# EAGLE design AF_mshield-v12 (EAGLE 5.01)
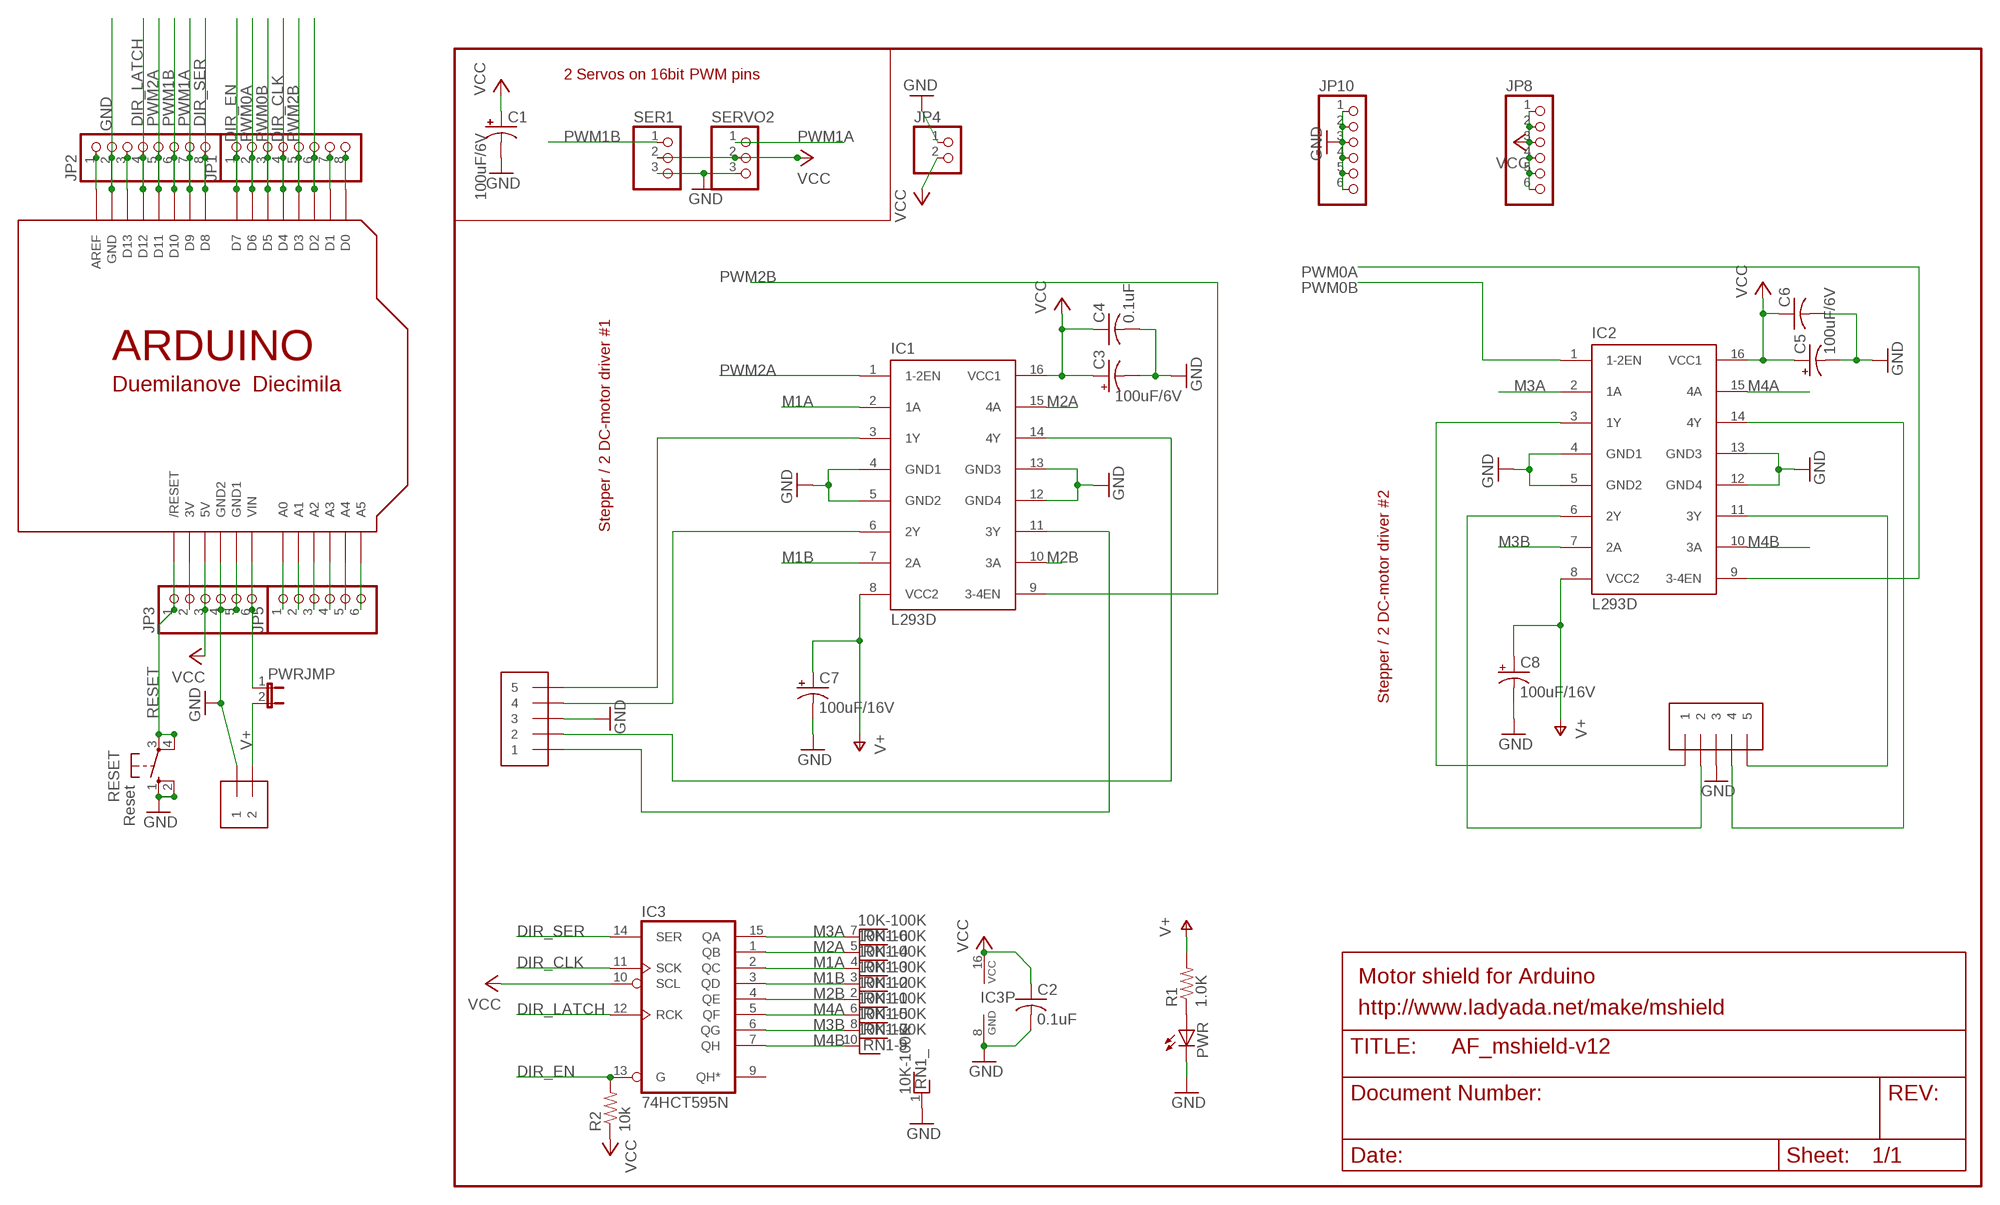
[diagram p0: schematic, sheet 1]

## Parts
C1  100uF/6V  CPOL-USE2.5-5  [E2,5-5]
C2  0.1uF  C-US025-025X050  [C025-025X050]
C3  100uF/6V  CPOL-USE2.5-5  [E2,5-5]
C4  0.1uF  C-US025-025X050  [C025-025X050]
C5  100uF/6V  CPOL-USE2.5-5  [E2,5-5]
C6  C-US025-025X050  [C025-025X050]
C7  100uF/16V  CPOL-USE2.5-6  [E2,5-6]
C8  100uF/16V  CPOL-USE2.5-6  [E2,5-6]
IC1  L293D  L293E  [DIL16]
IC2  L293D  L293E  [DIL16]
IC3  74HCT595N  [DIL16]
J1  1X5  [1X05-3.5MM]
J2  1X5  [1X05-3.5MM]
J3  1X2-3.5MM  [1X2-3.5MM]
JP1  PINHD-1X8CLEANBIG  [1X08-CLEANBIG]
JP2  PINHD-1X8CLEANBIG  [1X08-CLEANBIG]
JP3  PINHD-1X6CB  [1X06-CLEANBIG]
JP4  PINHD-1X2  [1X02]
JP5  PINHD-1X6CB  [1X06-CLEANBIG]
JP8  PINHD-1X6B  [1X06-BIG]
JP10  PINHD-1X6B  [1X06-BIG]
PWR  LED3MM  [LED3MM]
PWRJMP  JP1E  [JP1]
R1  1.0K  R-US_0207/10  [0207/10]
R2  10k  R-US_0207/10  [0207/10]
RESET  Reset  10-XX  [B3F-10XX]
RN1  10K-100K  RNX9  [RN-10]
SER1  PINHD-1X3  [1X03]
SERVO2  PINHD-1X3  [1X03]
U$1  ARDUINO-NOHOLE  [ARDUINO-NOHOLE]

## Nets
9V: JP3.6 PWRJMP.1 U$1.VIN
DIR_CLK: IC3.11(SCK) JP1.4 U$1.D4
DIR_EN: IC3.13(G) JP1.1 R2.2 U$1.D7
DIR_LATCH: IC3.12(RCK) JP2.4 U$1.D12
DIR_SER: IC3.14(SER) JP2.8 U$1.D8
GND [power]: C1.- C2.2 C3.- C4.2 C5.- C6.2 C7.- C8.- IC1.4(GND1) IC1.5(GND2) IC1.12(GND4) IC1.13(GND3) IC2.4(GND1) IC2.5(GND2) IC2.12(GND4) IC2.13(GND3) IC3.8(GND) J1.3 J2.3 J3.1 JP2.2 JP3.4 JP3.5 JP4.1 JP10.1 JP10.2 JP10.3 JP10.4 JP10.5 JP10.6 PWR.K(C) RESET.1(S) RESET.2(S1) RN1.1 SER1.3 SERVO2.3 U$1.GND U$1.GND1 U$1.GND2
M1A: IC1.2(1A) IC3.2(QC) RN1.4
M1B: IC1.7(2A) IC3.3(QD) RN1.3
M2A: IC1.15(4A) IC3.1(QB) RN1.5
M2B: IC1.10(3A) IC3.4(QE) RN1.2
M3A: IC2.2(1A) IC3.15(QA) RN1.7
M3B: IC2.7(2A) IC3.6(QG) RN1.8
M4A: IC2.15(4A) IC3.5(QF) RN1.6
M4B: IC2.10(3A) IC3.7(QH) RN1.10
N$1: IC1.3(1Y) J1.5
N$2: JP5.1 U$1.A0
N$3: JP5.2 U$1.A1
N$4: JP5.3 U$1.A2
N$5: JP5.4 U$1.A3
N$6: JP5.5 U$1.A4
N$7: IC2.3(1Y) J2.1
N$8: IC2.6(2Y) J2.2
N$9: IC2.11(3Y) J2.5
N$10: JP1.6 U$1.D2
N$11: JP1.7 U$1.D1
N$12: JP1.8 U$1.D0
N$13: JP5.6 U$1.A5
N$14: JP2.1 U$1.AREF
N$15: JP2.3 U$1.D13
N$17: JP3.2 U$1.3V
N$20: IC2.14(4Y) J2.4
N$31: IC1.6(2Y) J1.4
N$32: IC1.11(3Y) J1.1
N$33: IC1.14(4Y) J1.2
N$35: PWR.A R1.1
PWM0A: IC2.9(3-4EN) JP1.2 U$1.D6
PWM0B: IC2.1(1-2EN) JP1.3 U$1.D5
PWM1A: JP2.7 SERVO2.1 U$1.D9
PWM1B: JP2.6 SER1.1 U$1.D10
PWM2A: IC1.1(1-2EN) JP2.5 U$1.D11
PWM2B: IC1.9(3-4EN) JP1.5 U$1.D3
RESET: JP3.1 RESET.3(P) RESET.4(P1) U$1.RESET(/RESET)
V+: C7.+ C8.+ IC1.8(VCC2) IC2.8(VCC2) J3.2 PWRJMP.2 R1.2
VCC: C1.+ C2.1 C3.+ C4.1 C5.+ C6.1 IC1.16(VCC1) IC2.16(VCC1) IC3.10(SCL) IC3.16(VCC) JP3.3 JP4.2 JP8.1 JP8.2 JP8.3 JP8.4 JP8.5 JP8.6 R2.1 SER1.2 SERVO2.2 U$1.5V
Unconnected: IC3.9(QH*) RN1.9

## Notes on the sheet
- 2 Servos on 16bit PWM pins
- Stepper / 2 DC-motor driver #1
- Stepper / 2 DC-motor driver #2
- Motor shield for Arduino
- http://www.ladyada.net/make/mshield

## Library data of the parts
C1 C3 C5 C7 C8 = rcl-ez:CPOL-US: POLARIZED CAPACITOR, American symbol
C2 C4 C6 = rcl-ez:C-US: CAPACITOR, American symbol
IC1 IC2 = texas:L293E: TI DEVICE
IC3 = 74xx-eu:74*595: 8-bit SHIFT REGISTER, output latch
J1 J2 = adafruit:1X5
J3 = adafruit:1X2: 3.5mm Terminal block http://www.ladyada.net/library/pcb/eaglelibrary.html
JP1 JP2 = adafruit:PINHD-1X8: PIN HEADER
JP3 = adafruit:PINHD-1X6: PIN HEADER
JP4 = pinhead:PINHD-1X2: PIN HEADER
JP5 JP8 JP10 = carduino:PINHD-1X6: PIN HEADER
PWR = minimidi:LED: LED OSRAM: - CHIPLED LG R971, LG N971, LY N971, LG Q971, LY Q971, LO R971, LY R971 LH N974, LH R974 LS Q976, LO Q976, LY Q976 LO Q996 - Hyper CHIPLED LW Q18S LB Q993, LB Q99A, LB R99A - SideLED LS A670, LO A670, LY A670, LG A670, LP A670 LB A673, LV A673, LT A673, LW A673 LH A674 LY A675 LS A676, LA A676, LO A676, LY A676, LW A676 LS A679, LY A679, LG A679 - Hyper Micro SIDELED® LS Y876, LA Y876, LO Y876, LY Y876 LT Y87S - SmartLED LW L88C, LW L88S LB L89C, LB L89S, LG L890 LS L89K, LO L89K, LY L89K LS L896, LA L896, LO L896, LY L896 - TOPLED LS T670, LO T670, LY T670, LG T670, LP T670 LSG T670, LSP T670, LSY T670, LOP T670, LYG T670 LG T671, LOG T671, LSG T671 LB T673, LV T673, LT T673, LW T673 LH T674 LS T676, LA T676, LO T676, LY T676, LB T676, LH T676, LSB T676, LW T676 LB T67C, LV T67C, LT T67C, LS T67K, LO T67K, LY T67K, LW E67C LS E67B, LA E67B, LO E67B, LY E67B, LB E67C, LV E67C, LT E67C LW T67C LS T679, LY T679, LG T679 LS T770, LO T770, LY T770, LG T770, LP T770 LB T773, LV T773, LT T773, LW T773 LH T774 LS E675, LA E675, LY E675, LS T675 LS T776, LA T776, LO T776, LY T776, LB T776 LHGB T686 LT T68C, LB T68C - Hyper Mini TOPLED® LB M676 - Mini TOPLED Santana® LG M470 LS M47K, LO M47K, LY M47K Source: http://www.osram.convergy.de/
PWRJMP = jumper:JP1E: JUMPER
R1 R2 = rcl-ez:R-US_: RESISTOR, American symbol
RESET = switch-omron:10-XX: OMRON SWITCH
RN1 = resistor-net:RNX9: RESISTOR NETWORK
SER1 SERVO2 = pinhead:PINHD-1X3: PIN HEADER
U$1 = adafruit:ARDUINO: Arduino Diecimila/Duemilanove Make a shield with ease, this package has all the named pins as well as the two mounting drill holes and an outline of the USB and DC power connector. The outline is on the DIMENSION layer, so if your board house uses it they will cut the outline to match. http://www.ladyada.net/library/pcb/eaglelibrary.html

## Net classes
1 power: width 0.61 mm

## Board
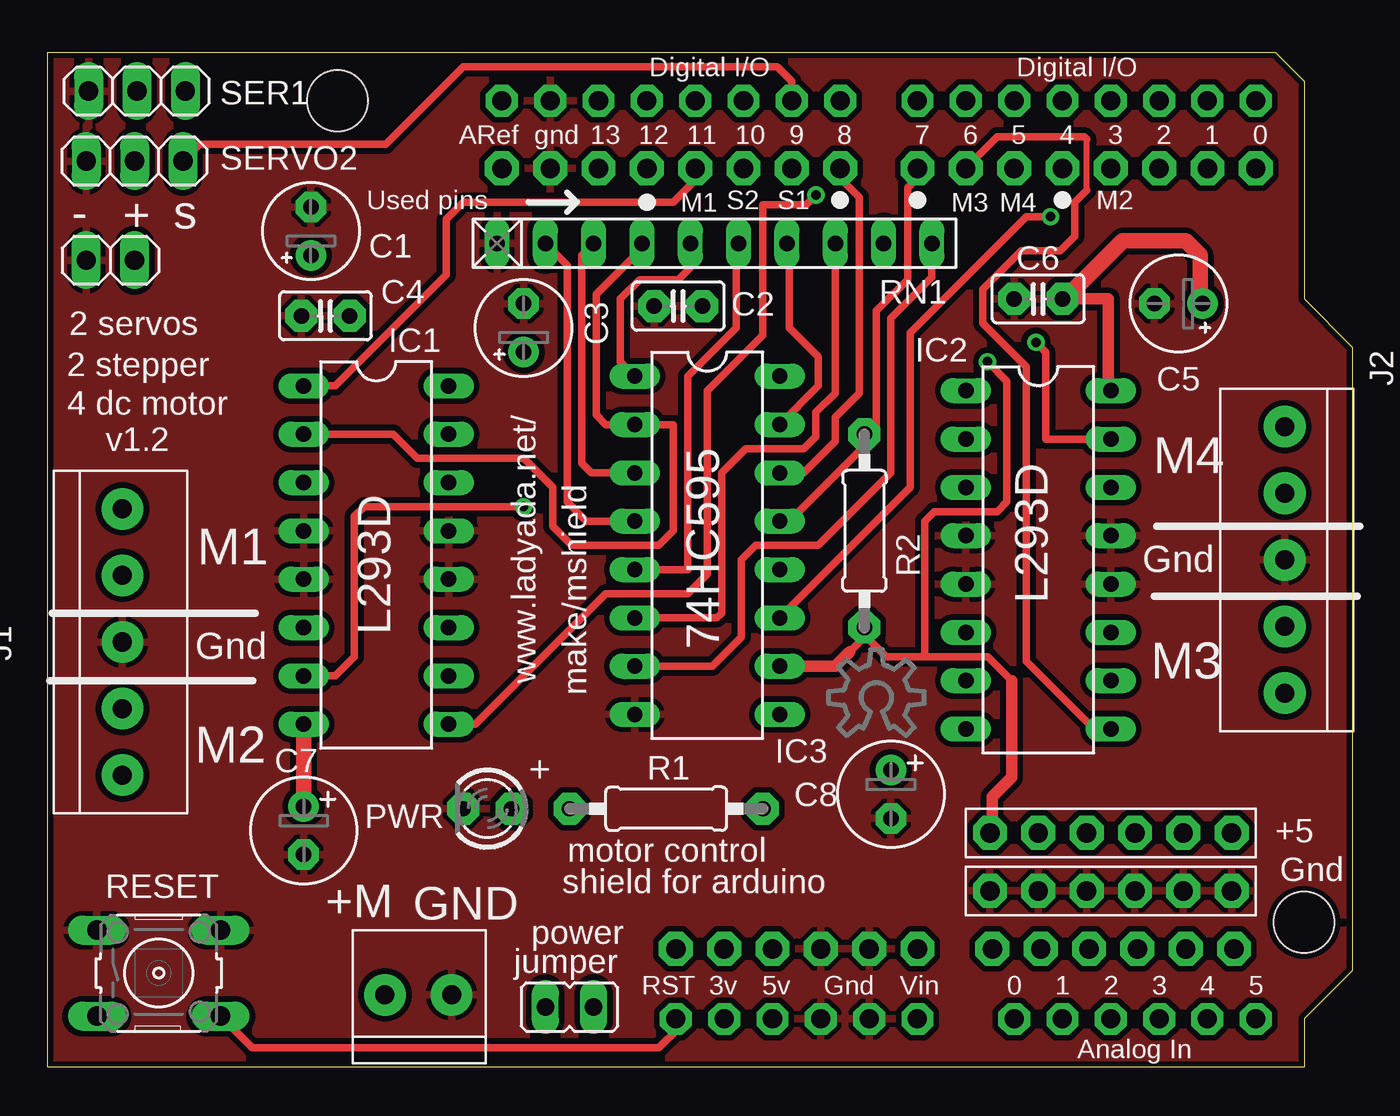
[diagram p1: board, top side]
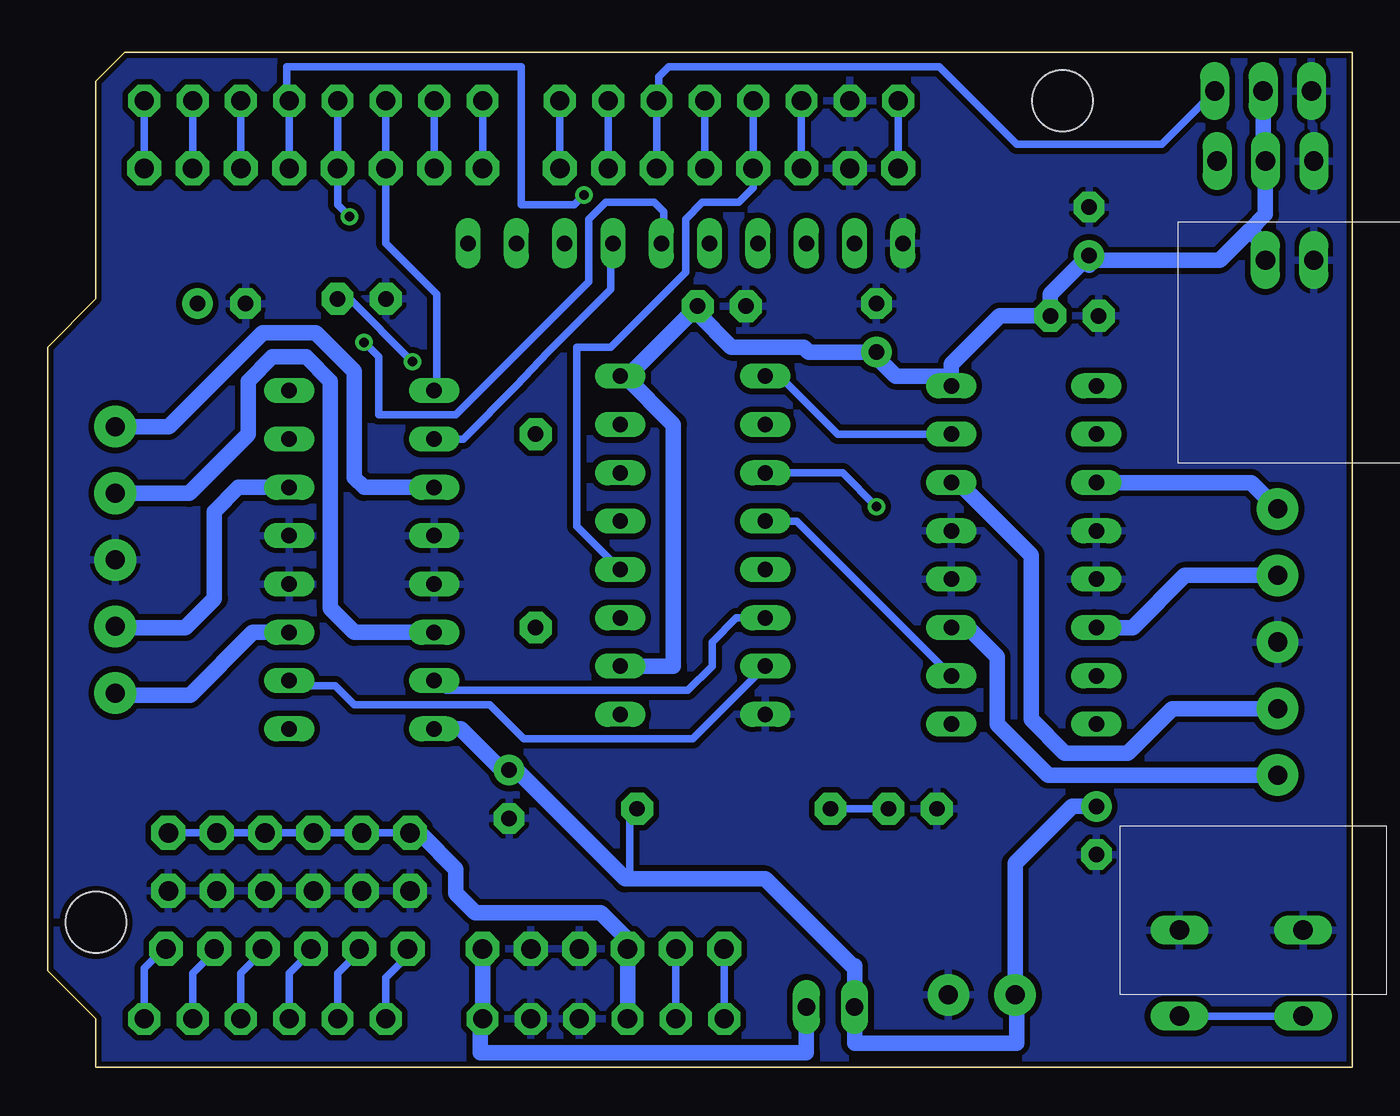
[diagram p2: board, bottom side, seen from below]

Size 68.58 x 53.34 mm. Coordinates in mm from the lower left corner, seen from the top.
Outline: 0,0 0,53.34 64.52,53.34 66.04,51.82 66.04,40.39 68.58,37.85 68.58,5.08 66.04,2.54 66.04,0 0,0
Copper layers (1*16): Top 0.035mm / dielectric 1.5mm / Bottom 0.035mm
Design rules "default *": minimum track width 12mil, minimum drill 19mil, track to track 12mil, track to pad 12mil, pad to pad 12mil, via to via 12mil, smd to smd 0mil, copper to edge 12mil, drill to drill 8mil, minimum pad ring 10mil, minimum via ring 8mil, stop-mask expansion 4mil, vias tented up to drill 20mil, thermal gap 10mil
Holes 3.2 mm at 66.04,7.62 15.24,50.8

### Footprints (pad centres in the part's own frame; a part is rotated, then mirrored left to right if it is on the bottom)
E2,5-5 = drill 0.813 pad 1.6 round: + -1.27,0 | drill 0.813 pad 1.6 octagon: - 1.27,0
C025-025X050 = drill 0.813 pad 1.676 octagon: 1 -1.27,0; 2 1.27,0
E2,5-6 = drill 0.813 pad 1.6 round: + -1.27,0 | drill 0.813 pad 1.6 octagon: - 1.27,0
DIL16 = drill 0.813 long: 1 -8.89,-3.81; 2 -6.35,-3.81; 3 -3.81,-3.81; 4 -1.27,-3.81; 5 1.27,-3.81; 6 3.81,-3.81; 7 6.35,-3.81; 8 8.89,-3.81; 9 8.89,3.81; 10 6.35,3.81; 11 3.81,3.81; 12 1.27,3.81; 13 -1.27,3.81; 14 -3.81,3.81; 15 -6.35,3.81; 16 -8.89,3.81
1X05-3.5MM = drill 1 pad 2.184 round: 1 7,0; 2 3.5,0; 3 0,0; 4 -3.5,0; 5 -7,0
1X2-3.5MM = drill 1 pad 2.184 round: 1 1.8,0; 2 -1.7,0
1X08-CLEANBIG = drill 1.016 pad 1.778 octagon: 1 -8.89,0; 2 -6.35,0; 3 -3.81,0; 4 -1.27,0; 5 1.27,0; 6 3.81,0; 7 6.35,0; 8 8.89,0
1X06-CLEANBIG = drill 1.016 pad 1.778 octagon: 1 -6.35,0; 2 -3.81,0; 3 -1.27,0; 4 1.27,0; 5 3.81,0; 6 6.35,0
1X02 = drill 1.016 long: 1 -1.27,0; 2 1.27,0
1X06-BIG = drill 1.016 pad 1.778 octagon: 1 -6.35,0; 2 -3.81,0; 3 -1.27,0; 4 1.27,0; 5 3.81,0; 6 6.35,0
LED3MM = drill 0.813 pad 1.676 octagon: A -1.27,0; K 1.27,0
JP1 = drill 0.914 long: 1 0,-1.27; 2 0,1.27
0207/10 = drill 0.813 pad 1.676 octagon: 1 -5.08,0; 2 5.08,0
B3F-10XX = drill 1.016 long: 1 -3.251,2.261; 2 3.251,2.261; 3 -3.251,-2.261; 4 3.251,-2.261
RN-10 = drill 0.813 long: 1 -11.43,0; 2 -8.89,0; 3 -6.35,0; 4 -3.81,0; 5 -1.27,0; 6 1.27,0; 7 3.81,0; 8 6.35,0; 9 8.89,0; 10 11.43,0
1X03 = drill 1.016 long: 1 -2.54,0; 2 0,0; 3 2.54,0
ARDUINO-NOHOLE = drill 1 pad 1.676 octagon: 3V 35.56,2.54; 5V 38.1,2.54; A0 50.8,2.54; A1 53.34,2.54; A2 55.88,2.54; A3 58.42,2.54; A4 60.96,2.54; A5 63.5,2.54; AREF 23.876,50.8; D0 63.5,50.8; D1 60.96,50.8; D2 58.42,50.8; D3 55.88,50.8; D4 53.34,50.8; D5 50.8,50.8; D6 48.26,50.8; D7 45.72,50.8; D8 41.656,50.8; D9 39.116,50.8; D10 36.576,50.8; D11 34.036,50.8; D12 31.496,50.8; D13 28.956,50.8; GND 26.416,50.8; GND1 43.18,2.54; GND2 40.64,2.54; RESET 33.02,2.54; VIN 45.72,2.54

### Placement (x,y rotation side)
C1  13.84,43.94 90 top
C2  33.15,40.01 180 top
C3  25.02,38.86 90 top
C4  14.61,39.5 180 top
C5  59.44,40.13 180 top
C6  52.07,40.39 180 top
C7  13.46,12.45 270 top
C8  44.32,14.35 270 top
E$1  [OSHWLOGO_TOL_0.2]  43.56,19.43 0 top
IC1  17.27,26.92 270 top
IC2  52.07,26.67 270 top
IC3  34.67,27.43 270 top
J1  3.94,22.35 270 top
J2  65.02,26.67 90 top
J3  19.43,3.81 0 top
JP1  54.61,47.24 0 top
JP2  32.77,47.24 0 top
JP3  39.37,6.22 0 top
JP4  3.3,42.42 0 top
JP5  56.01,6.22 0 top
JP8  55.88,12.32 0 top
JP10  55.88,9.27 0 top
PWR  23.11,13.59 180 top
PWRJMP  27.43,3.17 90 top
R1  32.51,13.59 0 top
R2  42.93,28.19 90 top
RESET  5.84,4.95 0 top
RN1  35.05,43.31 0 top
SER1  4.7,51.31 180 top
SERVO2  4.57,47.62 180 top
U$1  0,0 0 top

### Tracks (layer width: path | path; a pad name or v marks a point on that pad's centre or on a via)
9V
  Bottom 0.813: PWRJMP.1 28.7,0.76 45.85,0.76 45.85,2.54 U$1.VIN 45.72,5.97 45.59,6.1 JP3.6
DIR_CLK  (via drill 0.5)
  Top 0.406: IC3.11 45.34,30.48 45.34,38.61 51.44,44.7 v52.7,44.7
  Bottom 0.406: 53.21,51.05 53.34,51.05 U$1.D4 JP1.4 | JP1.4 53.47,47.24 | v52.7,44.7 53.34,45.34 JP1.4
DIR_EN
  Top 0.406: IC3.13 38.99,28.7 42.8,32.51 42.8,33.27 | JP1.1 45.72,46.74 45.21,46.23 45.21,41.4 43.56,39.75 43.56,33.02 43.05,33.02 42.8,33.27 | 42.8,33.27 R2.2
  Bottom 0.406: JP1.1 U$1.D7
DIR_LATCH
  Bottom 0.406: IC3.12 40.77,28.45 40.77,37.85 38.99,37.85 35.05,41.78 35.05,44.58 34.16,45.47 32.26,45.47 31.5,46.23 JP2.4 U$1.D12
DIR_SER
  Top 0.406: JP2.8 41.66,46.74 42.67,45.72 42.67,35.43 41.4,34.16 41.4,32.89 39.75,31.24 IC3.14
  Bottom 0.406: JP2.8 U$1.D8
GND
  pour Bottom: 0,53.34 69.22,53.98 69.22,-0.51 0,0
  pour Top: 0,53.34 68.96,53.09 68.71,0.25 0,0.25
M1A
  Top 0.406: RN1.4 31.24,43.05 28.83,40.64 28.83,34.29 29.34,33.78 IC3.2 32.89,33.78 32.89,28.19 32.13,27.43 27.56,27.43 26.54,28.45 26.54,30.48 25.02,32 19.43,32 18.16,33.27 IC1.2
M1B  (via drill 0.5)
  Top 0.406: IC3.3 28.57,31.24 28.07,31.75 28.07,42.67 RN1.3 | IC1.7 15.11,20.57 16.13,21.59 16.13,28.96 16.64,29.46 v25.02,29.46
  Bottom 0.406: v25.02,29.46 26.8,31.24 IC3.3
M2A
  Top 0.406: IC3.1 30.1,37.08 30.1,40.39 31.11,41.4 33.15,41.4 33.91,42.16 33.91,43.18 RN1.5
  Bottom 0.406: IC1.15 27.05,33.27 30.1,36.32 IC3.1 31.11,36.32
M2B
  Top 0.406: RN1.2 27.3,42.16 27.3,29.72 28.32,28.7 IC3.4
  Bottom 0.406: IC1.10 29.21,28.7 IC3.4
M3A
  Top 0.406: IC3.15 40.51,35.81 40.51,37.34 38.99,38.86 38.99,43.18 RN1.7
  Bottom 0.406: 38.73,43.43 RN1.7 38.99,43.18 38.99,40.89 42.29,37.59 43.94,35.81 46.74,33.02 IC2.2 48.39,33.02
M3B
  Top 0.406: RN1.8 41.4,35.43 40.39,34.42 40.39,33.15 39.75,32.51 36.7,32.51 35.43,31.24 35.43,23.88 35.18,23.62 IC3.6 30.61,23.62
  Bottom 0.406: IC3.6 32.38,23.62 33.66,22.35 33.66,21.08 34.92,19.81 47.62,19.81 48.13,20.32 IC2.7
M4A  (via drill 0.5)
  Top 0.406: IC3.5 33.66,26.16 33.66,36.32 36.2,38.86 36.2,43.18 RN1.6 | IC2.15 52.45,33.02 52.45,37.59 v51.94,38.1
  Bottom 0.406: v51.94,38.1 51.18,37.34 51.18,34.29 47.12,34.29 40.13,41.27 40.13,44.58 39.24,45.47 36.7,45.47 36.2,44.96 36.2,43.18 RN1.6
M4B
  Top 0.406: RN1.10 46.48,41.53 44.32,39.37 44.32,31.24 40.51,27.43 37.21,27.43 36.45,26.67 36.45,22.61 34.92,21.08 IC3.7 | IC3.7 30.35,20.57 | IC3.7 31.11,21.08
  Bottom 0.406: IC3.7 34.67,17.27 43.56,17.27 45.34,19.05 52.45,19.05 53.47,20.07 56.01,20.07 56.01,20.19 IC2.10
N$1
  Bottom 0.813: J1.5 5.32,30.73 IC1.3
N$2
  Bottom 0.406: JP5.1 49.53,6.22 49.4,6.1 50.8,4.7 U$1.A0
N$3
  Bottom 0.406: JP5.2 52.2,6.1 53.34,4.95 U$1.A1
N$4
  Bottom 0.406: JP5.3 54.74,6.1 55.88,4.95 U$1.A2
N$5
  Bottom 0.406: JP5.4 57.28,6.1 58.42,4.95 U$1.A3
N$6
  Bottom 0.406: JP5.5 59.82,6.1 60.96,4.95 U$1.A4
N$7
  Bottom 0.813: J2.1 62.21,33.67 57.28,38.61 54.48,38.61 52.45,36.58 52.45,30.99 51.94,30.48 IC2.3
N$8
  Bottom 0.813: J2.2 61.14,30.17 58.04,33.27 58.04,36.07 56.77,37.34 54.99,37.34 53.72,36.07 53.72,24.13 52.45,22.86 IC2.6
N$9
  Bottom 0.813: IC2.11 57.78,22.86 61.09,19.56 64.9,19.56 J2.5
N$10
  Bottom 0.406: U$1.D2 JP1.6 58.55,47.24
N$11
  Bottom 0.406: JP1.7 60.96,47.37 | 60.96,47.37 U$1.D1 | 60.96,47.37 61.09,47.37
N$12
  Bottom 0.406: JP1.8 U$1.D0
N$13
  Bottom 0.406: JP5.6 62.36,6.35 63.5,5.21 U$1.A5
N$14
  Bottom 0.406: U$1.AREF JP2.1 24.13,47.24
N$15
  Bottom 0.406: JP2.3 U$1.D13
N$17
  Bottom 0.406: U$1.3V 35.43,2.54 35.56,2.67 JP3.2
N$20
  Bottom 0.813: IC2.14 58.55,30.48 59.82,29.21 59.82,24.64 61.34,23.11 65.15,23.11 | 65.15,23.11 J2.4 | 65.15,23.11 65.41,23.11
N$31
  Bottom 0.813: J1.4 8.82,25.85 11.56,23.11 13.33,23.11 13.46,23.24 | 13.46,23.24 13.59,23.37 | 13.46,23.24 IC1.6
N$32
  Bottom 0.813: J1.1 15.99,15.35 18.67,18.03 18.67,21.59 20.19,23.11 IC1.11
N$33
  Bottom 0.813: J1.2 9.47,18.85 11.81,16.51 15.11,16.51 16.89,18.29 16.89,26.92 20.7,30.73 IC1.14
N$35
  Bottom 0.406: 27.56,13.59 R1.1 | PWR.A 27.56,13.59 | 27.56,13.59 27.56,13.72
PWM0A
  Top 0.305: 54.61,46.1 54.61,48.77
  Top 0.406: IC2.9 54.99,17.78 51.44,21.34 51.44,36.83 49.15,39.12 49.15,40.89 51.18,42.93 53.21,42.93 53.98,43.69 53.98,45.47 54.61,46.1 | JP1.2 49.91,48.9 54.48,48.9 54.61,48.77
  Bottom 0.406: JP1.2 48.26,47.62 | 48.26,47.62 U$1.D6 | 48.26,47.62 48.01,47.62
PWM0B
  Bottom 0.406: 48.26,35.43 48.39,35.31 | 48.26,35.43 IC2.1 | 48.26,35.43 48.13,35.56 48.13,40.64 50.8,43.31 JP1.3 U$1.D5
PWM1A
  Top 0.406: SERVO2.1 8,48.51 17.78,48.51 21.84,52.58 38.35,52.58 39.12,51.82 U$1.D9
  Bottom 0.406: U$1.D9 JP2.7
PWM1B
  Bottom 0.406: SER1.1 10.03,48.51 17.65,48.51 21.72,52.58 35.94,52.58 36.45,52.07 36.45,50.93 U$1.D10 JP2.6 36.7,47.24
PWM2A
  Top 0.406: IC1.1 15.11,35.81 20.95,41.66 20.95,44.58 21.84,45.47 32.89,45.47 34.04,46.61 JP2.5
  Bottom 0.406: JP2.5 U$1.D11
PWM2B  (via drill 0.5)
  Top 0.406: IC1.9 22.48,18.03 29.34,24.89 33.66,24.89 34.67,25.91 34.67,35.56 37.59,38.48 37.59,45.34 39.88,45.34 v40.39,45.85
  Bottom 0.406: 55.75,47.24 JP1.5 U$1.D3 55.88,50.67 | v40.39,45.85 40.89,45.34 43.69,45.34 43.69,52.58 56.01,52.58 56.01,50.67 55.88,50.67 | 55.88,50.67 55.75,50.67
RESET
  Top 0.406: RESET.4 10.77,1.02 32.13,1.02 33.15,2.03 33.15,2.54 U$1.RESET
  Bottom 0.406: 9.12,2.69 RESET.4 | RESET.3 9.12,2.69 | 9.12,2.69 9.27,2.54 | U$1.RESET 33.02,2.67 33.15,2.79 33.02,2.92 JP3.1
V+
  Top 0.813: C7.+ IC1.8
  Bottom 0.406: 38.23,9.91 37.97,10.16 37.97,13.21 R1.2
  Bottom 0.813: C7.+ 14.73,13.72 17.73,10.72 J3.2 17.73,3.56 17.65,3.56 17.65,1.27 26.16,1.27 PWRJMP.2 26.16,5.33 26.29,5.33 30.86,9.91 38.23,9.91 43.81,15.49 44.45,15.49 | 44.45,15.49 44.58,15.49 46.86,17.78 IC2.8 48.39,17.78 | 44.45,15.49 C8.+
VCC  (via drill 0.5)
  Top 0.406: 46.1,21.59 44.07,21.59 42.8,22.86 42.8,23.11 | 50.67,20.32 49.4,21.59 46.1,21.59 | JP8.1 49.66,12.19 | 46.1,21.59 46.1,28.7 46.61,29.21 49.91,29.21 50.42,29.72 50.42,36.07 v49.4,37.08 | 42.8,23.11 R2.1 | 42.16,21.84 42.8,22.48 42.8,23.11
  Top 0.61: IC3.10 41.4,21.08 42.16,21.84 | 50.67,20.32 50.67,15.24 49.66,14.22 49.66,12.19 | IC2.16 55.75,35.56 55.75,40.39 53.47,40.39
  Top 0.813: C6.1 53.47,40.39 56.52,43.43 59.82,43.43 60.58,42.67 60.58,40.13 C5.+
  Bottom 0.406: JP8.5 JP8.6 | JP8.5 59.56,12.19 | JP8.4 JP8.5 | JP8.4 57.02,12.19 | JP8.3 JP8.4 | JP8.3 54.48,12.19 | JP8.2 JP8.3 | JP8.2 51.94,12.19 | JP8.1 49.66,12.19 49.78,12.32 JP8.2 | 53.47,40.39 C6.1 52.7,40.39 v49.4,37.08
  Bottom 0.813: SER1.2 4.7,47.5 SERVO2.2 4.57,44.83 5.4,44.01 | 5.4,44.01 6.98,42.42 13.59,42.42 13.84,42.16 C1.+ 15.88,40.64 C4.1 18.54,39.5 21.08,36.96 IC1.16 21.59,36.32 24,36.32 25.02,37.34 C3.+ 28.57,37.59 28.83,37.85 32.64,37.85 34.42,39.62 C2.1 38.1,36.32 IC3.16 38.23,36.32 35.69,33.78 35.69,21.08 IC3.10 38.73,21.08 | JP8.1 49.4,12.19 48.9,12.19 47.12,10.41 47.12,9.14 46.1,8.13 39.5,8.13 37.97,6.6 37.97,5.84 38.1,5.97 JP3.3 | U$1.5V JP3.3 | JP3.3 38.23,6.35 | JP4.2 4.57,43.18 5.4,44.01

### Text on the board
tPlace: Used pins | M1 | S2 | S1 | M3 | M4 | M2 | - | + | s | 2 servos | 2 stepper | 4 dc motor | www.ladyada.net/ | M4 | v1.2 | M1 | Gnd | L293D | L293D | 74HC595 | M3 | Gnd | make/mshield | M2 | + | +5 | motor control | +M | GND | Gnd | shield for arduino | power | jumper